# Altium schematic sheet Debug_Port.SchDoc
size A
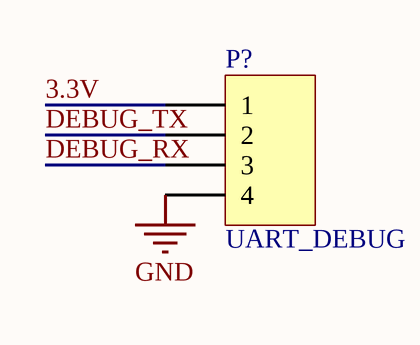
[diagram p0: Debug_Port.SchDoc]

## Parts
P?  UART_DEBUG  [HDR1X4]

## Nets
GND: P?.4
3.3V: P?.1
DEBUG_RX: P?.3
DEBUG_TX: P?.2

## Library data of the parts
P? = Header 4: Header, 4-Pin; LatestRevisionDate: 17-Jul-2002; LatestRevisionNote: Re-released for DXP Platform.; Publisher: Altium Limited